# EasyEDA Pro project ProPrj_CWATCH_2025-07-30.epro, board PCB2
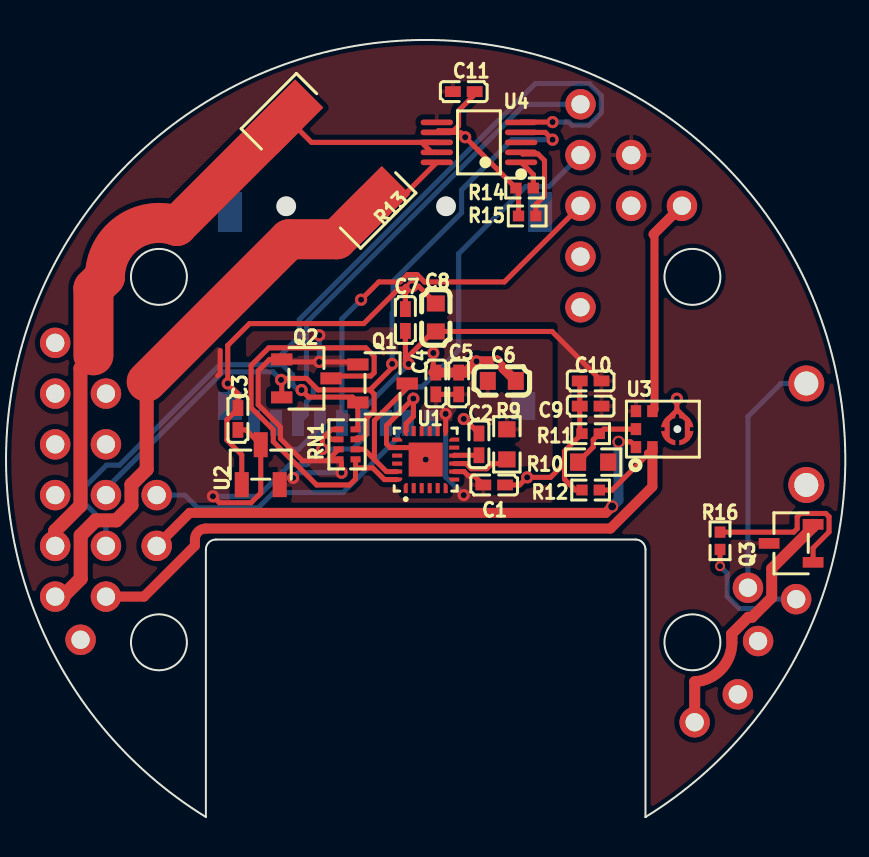
[diagram p5: board, top side]
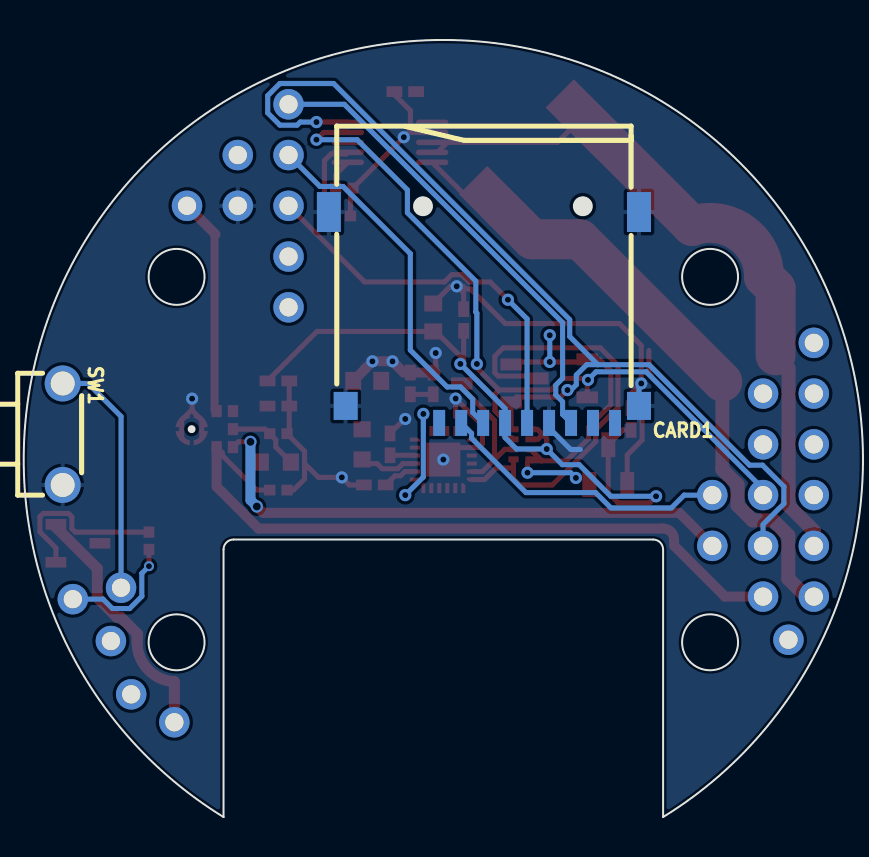
[diagram p6: board, bottom side, seen from below]

Outline 42 x 38.89 mm; copper layers: Top Layer, Bottom Layer. Coordinates in mm from the lower left corner of the outline.
Outline path: circle c7.65,27.03 r1.4 ; circle c7.65,8.74 r1.4 ; circle c34.35,27.03 r1.4 ; circle c34.35,8.74 r1.4 ; 10,13.39 10,0 arc(21,38.89) 32,0 arc(32,0) 32,0 32,13.39 arc(31.85,13.74) 31.5,13.89 10.5,13.89 arc(10.15,13.74) 10,13.39
Stack: Top Layer 0.035mm / Dielectric1 1.51mm FR4 er 4.5 / Bottom Layer 0.035mm

## Design rules (mm)
template: Custom Config
spacing copperThickness1oz (default): track to track 0.102, other pairs 0.152 to 0.3
spacing copperThickness2oz: track to track 0.203, other pairs 0.152 to 0.3
track width copperThickness1oz (default): min 0.127, default 0.254, max 2.54
track width copperThickness2oz: min 0.203, default 0.254, max 2.54
differential pair differentialPair (default): width min 0.127, default 0.254, max 2.54; gap min 0.152, default 0.152
via viaSize (default): diameter min 0.4, default 0.5, max 10; hole min 0.3, default 0.3, max 6.3

## Placement (name value [footprint] x y rotation side)
C1  100nF  [C0402]  24.43 16.62 0 top
C2  100nF  [C0402]  23.67 18.65 270 top
C3  1uF  [C0402]  11.6 19.92 270 top
C4  1uF  [C0402]  21.51 21.7 270 top
C5  100nF  [C0402]  22.65 21.7 270 top
C6  10uF  [C0603]  24.81 21.83 180 top
C7  100nF  [C0402]  19.98 24.87 270 top
C8  10uF  [C0603]  21.51 25 270 top
C9  1uF  [C0402]  29.25 20.56 0 top
C10  100nF  [C0402]  29.25 21.83 0 top
C11  100nF  [C0402]  22.91 36.3 0 top
CARD1  TF-01A  [TF-SMD_TF-01A]  18.97 25 0 bottom
NOREF  -  [Pad_e31]  39.54 10.9 0 top
NOREF#2  -  [Pad_e34]  34.46 4.74 0 top
NOREF#3  -  [Pad_e2]  2.46 21.19 0 top
NOREF#4  -  [Pad_e12]  28.75 28.05 0 top
NOREF#5  -  [Pad_e8]  5 16.11 0 top
NOREF#6  -  [Pad_e29]  5 11.03 0 top
NOREF#7  -  [Pad_e11]  28.75 25.51 0 top
NOREF#8  -  [Pad_e185]  3.73 8.87 0 top
NOREF#9  -  [Pad_e10]  5 21.19 0 top
NOREF#10  -  [Pad_e1]  2.46 23.73 0 top
NOREF#11  -  [Pad_e4]  2.46 16.11 0 top
NOREF#12  -  [Pad_e13]  28.75 30.59 0 top
NOREF#13  -  [Pad_e17]  31.29 30.59 0 top
NOREF#14  -  [Pad_e30]  7.54 13.57 0 top
NOREF#15  -  [Pad_e16]  31.29 33.13 0 top
NOREF#16  -  [Pad_e0]  37.13 11.47 0 top
NOREF#17  -  [Pad_e2627]  7.54 16.11 0 top
NOREF#18  -  [Pad_e9]  5 18.65 0 top
NOREF#19  -  [Pad_e33]  36.62 6.14 0 top
NOREF#20  -  [Pad_e3]  2.46 18.65 0 top
NOREF#21  -  [Pad_e5]  2.46 13.57 0 top
NOREF#22  -  [Pad_e32]  37.64 8.81 0 top
NOREF#23  -  [Pad_e7]  5 13.57 0 top
NOREF#24  -  [Pad_e266]  33.83 30.59 0 top
NOREF#25  -  [Pad_e15]  28.75 35.67 0 top
NOREF#26  -  [Pad_e14]  28.75 33.13 0 top
NOREF#27  -  [Pad_e6]  2.46 11.03 0 top
Q1  BSS138  [SOT-23-3_L2.9-W1.6-P1.90-LS2.8-BR]  18.84 21.7 180 top
Q2  BSS138  [SOT-23-3_L2.9-W1.6-P1.90-LS2.8-BR]  15.03 21.95 180 top
Q3  SI2301CDS-T1-GE3  [SOT-23-3_L3.0-W1.7-P0.95-LS2.9-BR]  39.29 13.7 0 top
R9  4.7kΩ  [R0603]  25.06 18.65 90 top
R10  68Ω  [R0603]  29.38 17.76 0 top
R11  47kΩ  [R0402]  29.25 19.18 0 top
R12  47kΩ  [R0402]  29.25 16.36 0 top
R13  20mΩ  [RES-SMD_L6.4-W3.2-R2512]  16.17 32.87 135 top
R14  10kΩ  [R0402]  25.95 31.48 180 top
R15  10kΩ  [R0402]  26.08 30.08 180 top
R16  1kΩ  [R0402]  35.73 13.82 90 top
RN1  10kΩ  [RES-ARRAY-SMD_0402-8P-L2.0-W1.0-BL]  17.06 18.65 270 top
SW1  TC-1101DE-C-A  [KEY-TH_L6.1-W3.8-P5.08]  40.05 19.16 270 bottom
U1  ICM-20948  [QFN-24_L3.0-W3.0-P0.40-BL-EP]  21 17.89 0 top
U2  SSP6206-18NR  [SOT-23-3_L2.9-W1.3-P1.90-LS2.4-BR]  12.75 17.63 270 top
U3  ICS-43434  [MIC-SMD_6P-L3.5-W2.7-P0.90-BL]  32.81 19.41 0 top
U4  INA226AIDGSR  [MSOP-10_L3.0-W3.0-P0.50-LS5.0-BL]  23.67 33.76 90 top

## Footprints (pads in the part's own frame, mm; a bottom-side part is the same pattern mirrored in y, then rotated)
C0402
  rect 0.79x0.54 smd: 1(-0.545,0) 2(0.545,0)
C0603
  rect 0.8x0.9 smd: 1(-0.7,0) 2(0.7,0)
KEY-TH_L6.1-W3.8-P5.08
  round 1.8 hole 1.2: 1(-2.54,0) 2(2.54,0)
MIC-SMD_6P-L3.5-W2.7-P0.90-BL
  rect 0.52x0.6 smd: 1(-1.286,-0.9) 2(-0.465,-0.9) 4(-0.465,0.9) 5(-1.286,0.9) 6(-1.286,0)
  custom 0.709x0.71 smd: 3(0.276,-0.452) 3(0.329,0.505) 3(1.234,-0.505) 3(1.286,0.452)
MSOP-10_L3.0-W3.0-P0.50-LS5.0-BL
  oval 0.28x1.62 smd: 1(-1,-2.11) 2(-0.5,-2.11) 3(0,-2.11) 4(0.5,-2.11) 5(1,-2.11) 6(1,2.11) 7(0.5,2.11) 8(0,2.11) 9(-0.5,2.11) 10(-1,2.11)
Pad_e0
  round 1.524 hole 0.914: 1(0,0)
Pad_e1
  round 1.524 hole 0.914: 1(0,0)
Pad_e2
  round 1.524 hole 0.914: 2(0,0)
Pad_e3
  round 1.524 hole 0.914: 3(0,0)
Pad_e4
  round 1.524 hole 0.914: 4(0,0)
Pad_e5
  round 1.524 hole 0.914: 5(0,0)
Pad_e6
  round 1.524 hole 0.914: 6(0,0)
Pad_e7
  round 1.524 hole 0.914: 10(0,0)
Pad_e8
  round 1.524 hole 0.914: 9(0,0)
Pad_e9
  round 1.524 hole 0.914: 8(0,0)
Pad_e10
  round 1.524 hole 0.914: 7(0,0)
Pad_e11
  round 1.524 hole 0.914: 5(0,0)
Pad_e12
  round 1.524 hole 0.914: 4(0,0)
Pad_e13
  round 1.524 hole 0.914: 3(0,0)
Pad_e14
  round 1.524 hole 0.914: 2(0,0)
Pad_e15
  round 1.524 hole 0.914: 1(0,0)
Pad_e16
  round 1.524 hole 0.914: 6(0,0)
Pad_e17
  round 1.524 hole 0.914: 8(0,0)
Pad_e29
  round 1.524 hole 0.914: 6(0,0)
Pad_e30
  round 1.524 hole 0.914: 6(0,0)
Pad_e31
  round 1.524 hole 0.914: 2(0,0)
Pad_e32
  round 1.524 hole 0.914: 2(0,0)
Pad_e33
  round 1.524 hole 0.914: 2(0,0)
Pad_e34
  round 1.524 hole 0.914: 2(0,0)
Pad_e185
  round 1.524 hole 0.914: 1(0,0)
Pad_e266
  round 1.524 hole 0.914: 8(0,0)
Pad_e2627
  round 1.524 hole 0.914: 9(0,0)
QFN-24_L3.0-W3.0-P0.40-BL-EP
  custom 0.2x0.506 smd: 1(-1,-1.427) 6(1,-1.427) 13(1,1.427) 18(-1,1.427)
  rect 0.2x0.505 smd: 2(-0.6,-1.427) 3(-0.2,-1.427) 4(0.2,-1.427) 5(0.6,-1.427) 14(0.6,1.427) 15(0.2,1.427) 16(-0.2,1.427) 17(-0.6,1.427)
  custom 0.506x0.2 smd: 7(1.427,-1) 12(1.427,1) 19(-1.427,1) 24(-1.427,-1)
  rect 0.505x0.2 smd: 8(1.427,-0.6) 9(1.427,-0.2) 10(1.427,0.2) 11(1.427,0.6) 20(-1.427,0.6) 21(-1.427,0.2) 22(-1.427,-0.2) 23(-1.427,-0.6)
  rect 1.7x1.7 smd: 25(0,0)
R0402
  rect 0.566x0.54 smd: 1(-0.433,0) 2(0.433,0)
R0603
  rect 0.806x0.864 smd: 1(-0.753,0) 2(0.753,0)
RES-ARRAY-SMD_0402-8P-L2.0-W1.0-BL
  rect 0.3x0.505 smd: 1(-0.75,0.427) 2(-0.25,0.427) 3(0.25,0.427) 4(0.75,0.427) 5(0.75,-0.427) 6(0.25,-0.427) 7(-0.25,-0.427) 8(-0.75,-0.427)
RES-SMD_L6.4-W3.2-R2512
  rect 2x3.3 smd: 1(-3.067,0) 2(3.067,0)
SOT-23-3_L2.9-W1.3-P1.90-LS2.4-BR
  rect 1.25x0.7 smd: 1(1,-0.95) 2(1,0.95) 3(-1,0)
SOT-23-3_L2.9-W1.6-P1.90-LS2.8-BR
  rect 1.07x0.6 smd: 1(1.235,-0.95) 2(1.235,0.95) 3(-1.235,0)
SOT-23-3_L3.0-W1.7-P0.95-LS2.9-BR
  rect 1.038x0.532 smd: 1(1.101,-0.95) 2(1.101,0.95) 3(-1.101,0)
TF-SMD_TF-01A
  rect 0.6x1.3 smd: 1(2.24,5.276) 2(1.14,5.276) 3(0.04,5.276) 4(-1.06,5.276) 5(-2.16,5.276) 6(-3.26,5.276) 7(-4.36,5.276) 8(-5.46,5.276) 9(-6.56,5.276)
  rect 1.2x1.4 smd: 10(-7.76,4.426) 13(6.92,4.426)
  rect 1.2x2 smd: 11(-7.76,-5.276) 12(7.76,-5.276)

## Nets
1.8V: C1.1 C4.2 C5.2 C6.2 Q1.1 Q2.1 R9.2 RN1.5 RN1.6 U1.8 U1.13 U2.2
3.3V: C3.2 C7.2 C8.2 C9.2 C10.2 C11.1 CARD1.4 NOREF#15.6 Q3.3 RN1.7 RN1.8 U2.3 U3.5 U4.6
GND: C1.2 C2.1 C3.1 C4.1 C5.1 C6.1 C7.1 C8.1 C9.1 C10.1 C11.2 CARD1.6 CARD1.10 CARD1.11 CARD1.12 CARD1.13 NOREF#13.8 R11.1 R12.1 R14.2 R15.2 SW1.2 U1.18 U1.20 U1.25 U2.1 U3.3 U4.7
PGND: NOREF#8.1
VBAT: NOREF#21.5 R13.2 U4.8 U4.9
VBATIN: NOREF#27.6 R13.1 U4.10
ADR_1.8V: R9.1 U1.9
AUX_SCL: U1.7
AUX_SDA: U1.21
BCLK: NOREF#24.8 U3.4
BLA: NOREF#9.7
CD: CARD1.9
CS2: CARD1.2 NOREF#17.9
CSO: NOREF#4.4
DATA: R10.2
DC: NOREF#7.5
FSYNC: U1.11
INT_1.8V: U1.12
IO2: NOREF#19.2
IO3: NOREF#22.2
IO16: NOREF#10.1
IO17: NOREF#3.2
IO39: NOREF#16.1 SW1.1
IO40: NOREF.2 R16.1
L_RST: NOREF#18.8
M_3.3V: NOREF#2.2 Q3.2
MISO: CARD1.7 NOREF#25.1
MOSI: CARD1.3 NOREF#26.2
SCK: CARD1.5 NOREF#12.3
SCL: NOREF#23.10 Q1.2 RN1.1 U4.5
SCL_1.8V: Q1.3 RN1.3 U1.23
SDA: NOREF#5.9 Q2.2 RN1.2 U4.4
SDA_1.8V: Q2.3 RN1.4 U1.24
SELECT: NOREF#6.6 R12.2 U3.2
TP_INT: NOREF#11.4
TP_RST: NOREF#20.3
WS: NOREF#14.6 U3.1
$1N443: C2.2 U1.10
$1N2802: R10.1 R11.2 U3.6
$1N4154: R14.1 U4.1
$1N4205: R15.1 U4.2
$1N6080: Q3.1 R16.2

Pads without a net: CARD1 1 8; U1 1 2 3 4 5 6 14 15 16 17 19 22; U4 3

## Via types
v1: diameter 0.61, hole 0.305, Top Layer to Bottom Layer, 26 vias
v2: diameter 0.61, hole 0.4, Top Layer to Bottom Layer, 2 vias
v3: diameter 0.5, hole 0.3, Top Layer to Bottom Layer, 1 via

## Routing (per net, layer and track width the routed paths; a pad name or vN(x,y) marks a point on that pad's centre or on a via; arc(x,y) is an arc through that point)
1.8V: length 26.2
  Top Layer w0.254: C4.2 C5.2 ; Q1.1 17.48,22.78 v1(15.67,22.78) 13.92,22.78 Q2.1 13.19,22.9 12.62,22.33 12.62,20.63 13.73,19.52 13.73,18.94 14.84,17.83 16.08,17.83 ; RN1.6 16.08,17.84 16.08,17.83 ; 16.08,17.83 16.56,17.83 RN1.5 16.79,17.75 v1(16.79,17.23) ; U1.13 v1(22,20.17) ; U1.8 22.92,17.29 23.13,17.08 23.43,17.08 C1.1
  Bottom Layer w0.254: v1(16.79,17.23) 14.62,17.23 v1(14.36,16.97) ; v1(22,20.17) 22,17.02 v1(22.91,16.11) ; v1(15.67,22.78) v1(15.67,24.11)
3.3V: length 36.5
  Top Layer w0.254: RN1.8 16.29,19.4 16.03,19.14 ; C7.2 19.98,22.9 ; 19.98,22.9 21.38,24.3 ; 19.98,22.9 19.98,22.84 v1(20.15,22.68) ; v1(10.35,16.05) 10.68,15.73 12.26,15.73 12.75,16.21 U2.3 12,19.38 C3.2 ; RN1.7 16.28,18.9 16.03,19.14 ; 10.59,22.08 10.71,22.21 10.71,23.35 ; 16.03,19.14 15.83,18.94 v1(15.83,18.42) ; C10.2 27.32,24.3 C8.2
  Bottom Layer w0.254: v1(20.15,22.68) 17.91,20.44 CARD1.4 17.91,18.99 17.34,18.42 v1(15.83,18.42) 15.04,17.63 14.2,17.63 12.62,16.05 v1(10.35,16.05)
GND: length 61.7
  Top Layer w0.254: U3.3 33.09,19.86 U3.3 33.57,20.35 33.57,20.39 ; 33.57,20.39 U3.3 34.1,18.96 U3.3 ; 33.57,20.39 v1(33.57,20.94) ; v1(20.33,26.56) 19.98,26.22 C7.1 ; v1(20.33,26.56) 20.65,26.56 C8.1 ; v1(20.33,26.56) 20.01,26.56 19.87,26.42 19.63,26.42 17.9,24.7 12.19,24.7 11.09,23.6 v1(11.09,21.7) 11.6,21.19 C3.1 11.6,20.43 11.05,19.89 11.05,18.86 11.79,18.12 U2.1 ; U1.18 20.02,19.34 20.02,19.68 20.38,20.05 v1(20.38,20.94) 19.04,19.6 19.04,18.67 19.23,18.49 U1.20 20.4,18.49 v1(21,17.89) ; C10.1 C9.1 28.71,19.3 R11.1 27.95,18.31 27.95,17.7 ; C1.2 25.7,16.62 v1(26.08,17) 27.25,17 27.95,17.7 ; R12.1 28.49,16.36 27.95,16.91 27.95,17.7 ; R15.2 25.65,31.35 R14.2 v1(22.98,34.02) 22.73,34.26 U4.7 21.64,34.34 22.4,34.34 22.65,34.59 22.65,35.35 23.45,36.16 C11.2 ; v1(22.91,19.92) 22.94,19.92 C2.1 ; v1(21.38,23.22) 21.38,22.24
  Top Layer w0.5: C6.1 24.91,22.42 24.91,22.44 v1(24.55,22.8) v1(23.54,22.8) 22.98,22.24 C5.1 21.38,22.24
  Bottom Layer w0.254: v1(11.09,21.7) 11.21,21.58 CARD1.10 ; CARD1.6 15.71,19.48 14.62,18.4 14.14,18.4
VBAT: length 36.4
  Top Layer w0.254: U4.9 21.29,33.26 20.79,33.76 ; 20.79,33.76 15.28,33.76 R13.2 ; 20.79,33.76 U4.8
  Top Layer w0.7: NOREF#21.5 2.46,14.32 3.72,15.59 3.72,22.45 4.37,23.1
  Top Layer w2: R13.2 8.54,29.58 arc(6.09,29.24) 4.95,27.03 4.37,26.45 4.37,23.1
VBATIN: length 32.5
  Top Layer w0.254: U4.10 19.5,30.71 R13.1
  Top Layer w0.7: 7.04,21.79 7.04,17.4 6.27,16.63 6.27,15.6 5.52,14.85 4.49,14.85 3.73,14.09 3.73,11.93 2.84,11.03 NOREF#27.6
  Top Layer w2: 7.04,21.79 14.16,28.91 16.55,28.91 R13.1
ADR_1.8V: length 2.9
  Top Layer w0.254: U1.9 23.02,17.69 23.28,17.43 24.05,17.43 24.31,17.69 24.86,17.69 R9.1
BCLK: length 10.9
  Top Layer w0.4: 32.4,20.37 32.45,20.42 32.45,29.11 32.4,29.16
  Top Layer w0.5: 32.4,29.16 NOREF#24.8 ; U3.4 32.4,20.37
CS2: length 14.7
  Bottom Layer w0.254: CARD1.2 19.59,19.2 19.59,18.96 16.87,16.24 13.38,16.24 12.61,15.47 9.59,15.47 8.95,16.11 NOREF#17.9
IO39: length 12.2
  Bottom Layer w0.254: NOREF#16.1 37.13,20.05 38.78,21.7 SW1.1
IO40: length 6.4
  Top Layer w0.254: v3(35.73,12.55) R16.1
  Bottom Layer w0.254: NOREF.2 38.03,10.9 37.56,10.43 36.7,10.43 36.09,11.04 36.09,12.2 v3(35.73,12.55)
M_3.3V: length 12.7
  Top Layer w0.55: NOREF#2.2 34.46,6.77 arc(35.79,7.39) 36.32,8.74 36.32,8.99 36.31,9.01 36.31,9.16 37.14,10 37.33,10 38.32,10.98 38.32,12.44 40.39,14.51 Q3.2
MISO: length 23.7
  Bottom Layer w0.254: CARD1.7 15.03,20.15 15.03,20.79 15.37,21.13 15.37,21.61 15.03,21.95 15.03,24.75 25.95,35.67 NOREF#25.1
MOSI: length 18.5
  Bottom Layer w0.254: CARD1.3 19.53,20.25 19.53,20.91 20.14,21.53 20.81,21.53 22.65,23.37 22.65,28.19 26.01,31.56 27.17,31.56 NOREF#26.2
SCK: length 19.8
  Top Layer w0.254: v1(17.77,25.89) 18.66,26.78 19.72,26.78 20.09,27.15 20.57,27.15 20.94,26.78 24.94,26.78 NOREF#12.3
  Bottom Layer w0.254: v1(17.77,25.89) 16.81,24.93 CARD1.5
SCL: length 50.3
  Top Layer w0.254: v1(14.79,21.37) 15.14,21.02 17.34,21.02 Q1.2 17.61,19.52 RN1.1 ; 25.78,34.76 25.79,34.78 v1(27.35,34.78)
  Bottom Layer w0.254: v1(14.79,21.37) 14.61,21.37 14.34,21.63 14.34,22.12 13.82,22.64 13.27,22.64 ; 13.27,22.64 14.68,24.05 14.68,24.89 26.49,36.71 29.18,36.71 29.79,36.1 29.79,35.24 29.18,34.63 28.32,34.63 28.16,34.78 v1(27.35,34.78) ; 13.27,22.64 10.7,22.64 5.68,17.61 5.03,17.61 3.96,16.54 3.96,15.68 5,14.64 NOREF#23.10
SCL_1.8V: length 7
  Top Layer w0.254: 18.44,17.89 19.04,17.29 U1.23 ; 18.44,17.89 18.44,19.84 20.08,21.49 Q1.3 ; 18.44,17.89 17.93,18.4 RN1.3
SDA: length 39.6
  Top Layer w0.254: 18.21,21.37 19.32,22.48 v1(19.32,22.68) ; 18.21,21.37 15.62,21.37 15.04,21.95 13.84,21.95 v1(13.76,21.88) 13.8,21.84 Q2.2 ; 18.21,21.37 18.42,21.16 18.42,20.33 18.02,19.93 18.02,19.13 17.86,18.97 17.56,18.97 RN1.2 ; v1(27.35,33.9) 26.98,34.26 25.78,34.26
  Bottom Layer w0.254: v1(27.35,33.9) 25.31,33.9 22.8,31.38 22.8,30.24 19.37,26.82 19.37,25.27 19.32,25.22 v1(19.32,22.68) ; NOREF#5.9 5,16.43 10.85,22.28 13.35,22.28 v1(13.76,21.88)
SDA_1.8V: length 22.5
  Top Layer w0.254: U1.24 18.93,16.89 18.35,17.47 17.49,17.47 ; 17.49,17.47 17.49,16.92 17.19,16.62 15.54,16.62 13.37,18.79 13.37,19.38 12.26,20.49 12.26,22.6 13.15,23.48 18,23.48 18.42,23.06 18.42,22.23 18.26,22.07 16.38,22.07 Q2.3 ; 17.49,17.47 17.49,17.47 RN1.4
SELECT: length 35.5
  Top Layer w0.254: U3.2 32.06,18.23 32.06,18.1 30.33,16.36 R12.2
  Top Layer w0.5: NOREF#6.6 6.9,11.03 9.45,13.58 9.45,13.89 arc(9.61,14.28) 10,14.44 30.25,14.44 32.35,16.53 U3.2
WS: length 28
  Top Layer w0.254: v2(30.65,18.78) 31.26,18.78 U3.1
  Top Layer w0.5: NOREF#14.6 9.19,15.22 30.01,15.22 v2(30.33,15.54)
  Bottom Layer w0.5: v2(30.33,15.54) 30.65,15.86 v2(30.65,18.78)
$1N443: length 1.2
  Top Layer w0.254: C2.2 22.44,18.11 U1.10
$1N2802: length 3.8
  Top Layer w0.254: R10.1 29.38,18.52 29.38,18.88 R11.2 29.92,19.41 U3.6
$1N4154: length 1.5
  Top Layer w0.254: R14.1 26.39,32.15 25.78,32.76
$1N4205: length 4.3
  Top Layer w0.254: 25.78,33.26 25.86,33.18 26.62,33.18 26.95,32.86 26.95,31.09 26.51,30.66 R15.1
$1N6080: length 8.9
  Top Layer w0.254: 35.73,14.26 39.42,14.26 39.59,14.43 39.59,15.03 39.75,15.19 41.02,15.19 41.19,15.03 41.19,14.27 40.39,13.47 Q3.1

## Copper pours and planes (outline as drawn; the poured copper is in the pictures)
1.8V on Top Layer: 12,24.51 27.35,24.51 27.35,13.44 12,13.44
3.3V on Top Layer: -0.46,39.35 42.34,39.35 42.34,-0.65 -0.46,-0.65
GND on Bottom Layer: -0.59,39.86 42.78,39.86 42.78,-1.03 -0.59,-1.03
